# EAGLE design 5V+9V (EAGLE 5.10)
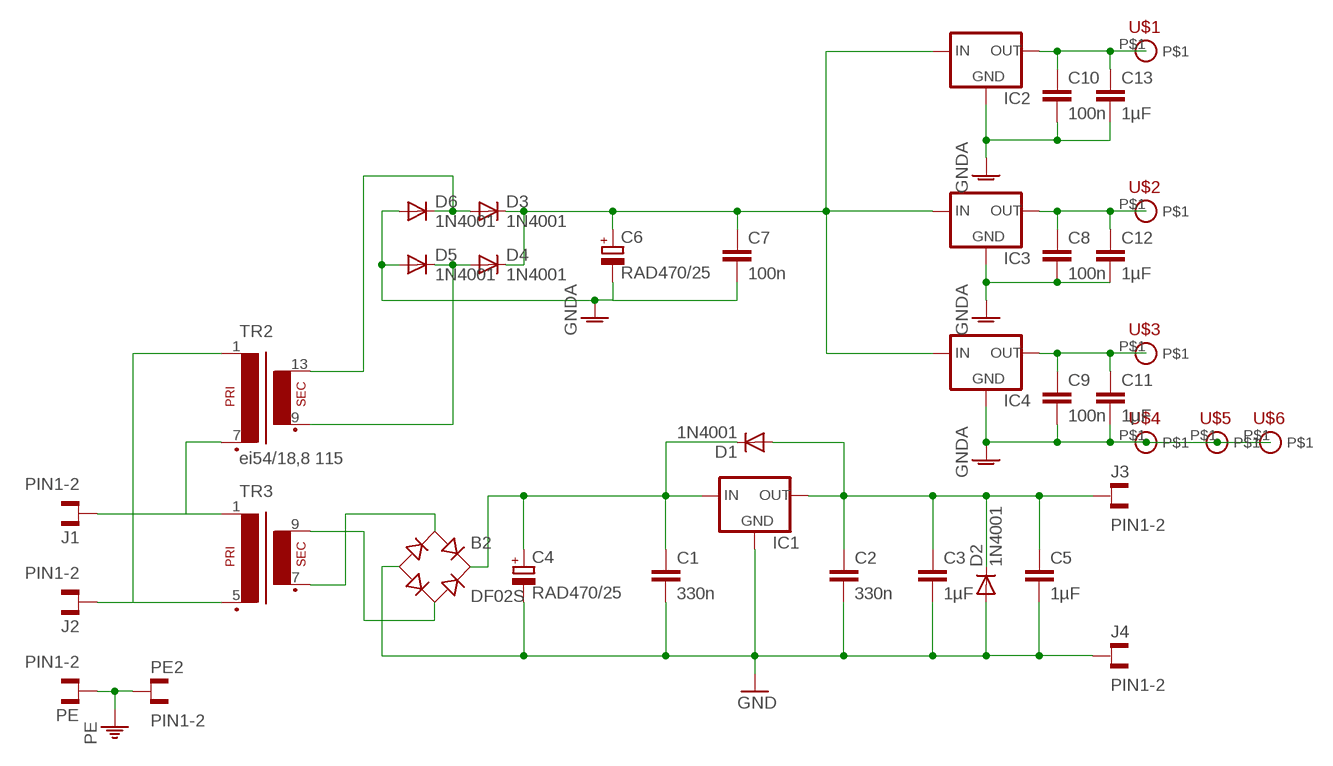
[diagram p0: schematic, sheet 1]

## Parts
B2  DF02S  [DFS]
C1  330n  C-EUC1812K  [C1812K]
C2  330n  C-EUC1812K  [C1812K]
C3  1µF  C-EUC0805  [C0805]
C4  RAD470/25  CPOL-EUE7.5-18  [E7,5-18]
C5  1µF  C-EUC0805  [C0805]
C6  RAD470/25  CPOL-EUE7.5-18  [E7,5-18]
C7  100n  C-EUC0805  [C0805]
C8  100n  C-EUC0805  [C0805]
C9  100n  C-EUC0805  [C0805]
C10  100n  C-EUC0805  [C0805]
C11  1µF  C-EUC0805  [C0805]
C12  1µF  C-EUC0805  [C0805]
C13  1µF  C-EUC0805  [C0805]
D1  1N4001  1N4148DO35-7  [DO35-7]
D2  1N4001  1N4148DO35-7  [DO35-7]
D3  1N4001  1N4004  [DO41-10]
D4  1N4001  1N4004  [DO41-10]
D5  1N4001  1N4004  [DO41-10]
D6  1N4001  1N4004  [DO41-10]
IC1  78XXL  [78XXL]
IC2  78XXS  [78XXS]
IC3  78XXS  [78XXS]
IC4  78XXS  [78XXS]
J1  PIN1-2  [62221]
J2  PIN1-2  [62221]
J3  PIN1-2  [62221]
J4  PIN1-2  [62221]
PE  PIN1-2  [62221]
PE2  PIN1-2  [62221]
TR2  ei54/18,8 115  EI54-1  [EI54-1]
TR3  EI38-1  [EI38-1]
U$1  1PIN  [1PIN]
U$2  1PIN  [1PIN]
U$3  1PIN  [1PIN]
U$4  1PIN  [1PIN]
U$5  1PIN  [1PIN]
U$6  1PIN  [1PIN]

## Nets
GND: B2.- C1.2 C2.2 C3.2 C4.- C5.2 D2.A IC1.GND J4.1
GNDA: C6.- C7.2 C8.2 C9.2 C10.2 C11.2 C12.2 C13.2 D5.A D6.A IC2.GND IC3.GND IC4.GND U$4.P$1 U$5.P$1 U$6.P$1
N$1: B2.AC2 TR3.9(S4)
N$2: B2.AC1 TR3.7(S3)
N$3: B2.+ C1.1 C4.+ D1.C IC1.IN
N$4: C2.1 C3.1 C5.1 D1.A D2.C IC1.OUT J3.1
N$5: J1.1 TR2.7(P2) TR3.1
N$6: D3.A D6.C TR2.13(S4)
N$9: D4.A D5.C TR2.9(S3)
N$10: J2.1 TR2.1 TR3.5(P2)
N$11: C6.+ C7.1 D3.C D4.C IC2.IN IC3.IN IC4.IN
N$13: C10.1 C13.1 IC2.OUT U$1.P$1
N$14: C8.1 C12.1 IC3.OUT U$2.P$1
N$15: C9.1 C11.1 IC4.OUT U$3.P$1
PE: PE2.1 PE.1

## Library data of the parts
B2 = rectifier:DF*S: Surface Mount Glass Passivated Bridge Rectifiers Source: Source: Comchip Bridge Rectifiers DF005S-G thru DF10S-G.pdf
C1-C3 C5 C7-C13 = rcl:C-EU: CAPACITOR, European symbol
C4 C6 = rcl:CPOL-EU: POLARIZED CAPACITOR, European symbol
D1 D2 = diode:1N4148: DIODE high speed (Philips)
D3-D6 = diode:1N4004: DIODE general purpose rectifier, 1 A
IC1 = v-reg:78XXL: VOLTAGE REGULATOR
IC2-IC4 = v-reg:78XXS: VOLTAGE REGULATOR
J1-J4 PE PE2 = con-faston:PIN1-2: CONN TAB FASTON BRASS .187 PCB TAB, FSSTON, DUAL STAKE, .187 SERIES Digi-Key Part Number: A24734CT-ND Source: Tyco Electronics Corporation .. ENG_CD_62221_R.pdf http://search.digikey.com/scripts/DkSearch/dksus.dll?Detail&name=A24734CT-ND
TR2 = trafo:EI54-1: TRANSFORMER 1 primary winding, 1 secondary winding ERA
TR3 = trafo:EI38-1: TRANSFORMER 1 primary winding, 1 secondary winding ERA
U$1-U$6 = pins:1PIN

## Board
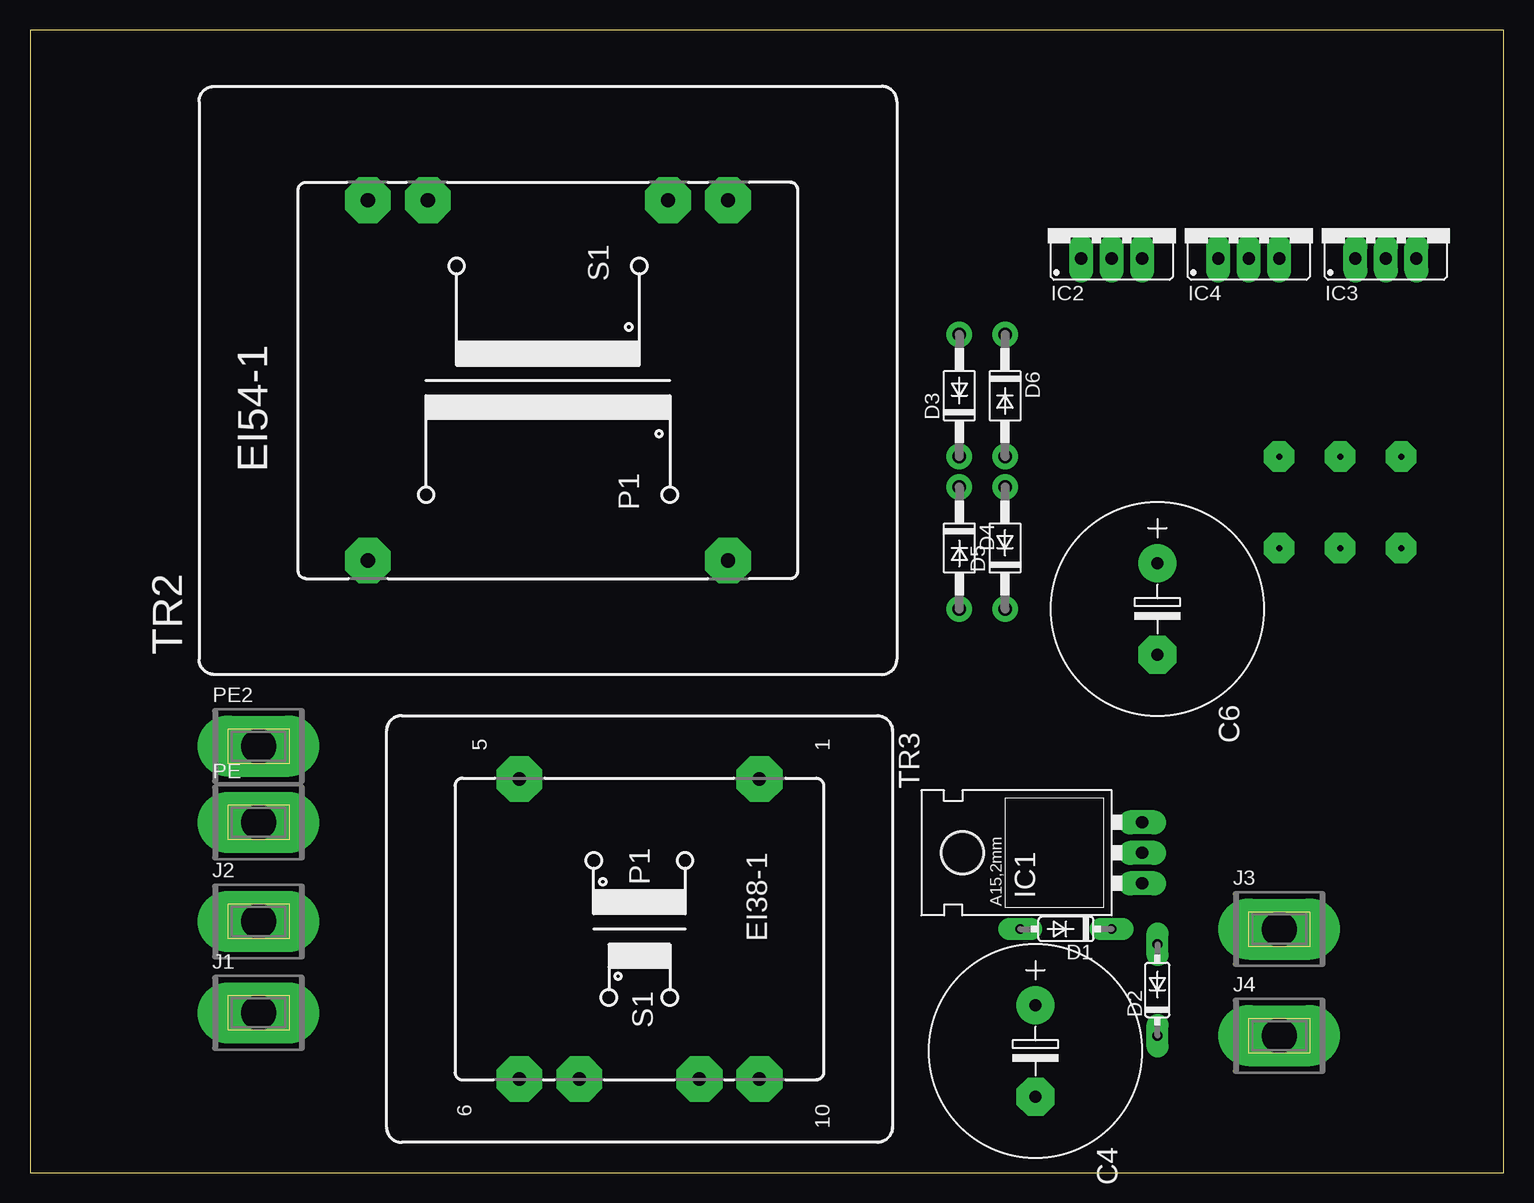
[diagram p1: board, top side]
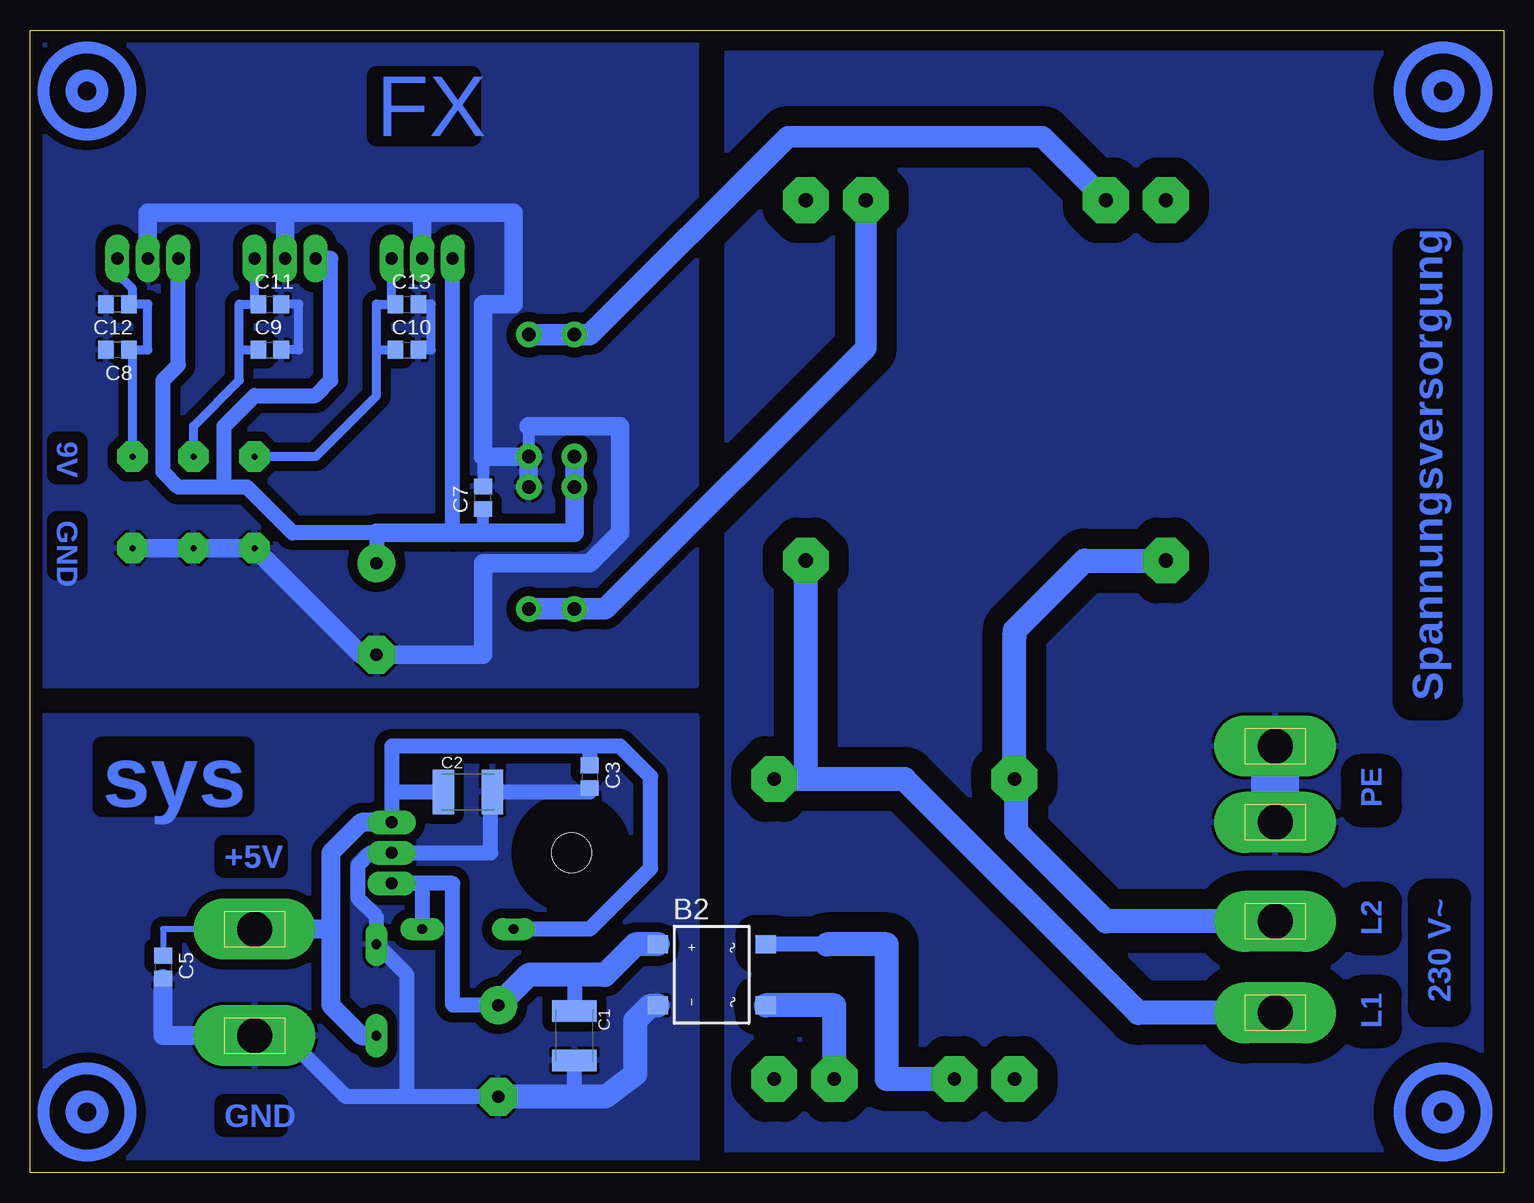
[diagram p2: board, bottom side, seen from below]

Size 122.86 x 95.24 mm. Coordinates in mm from the lower left corner, seen from the top.
Outline: 0,0 122.86,0 122.86,95.24 0,95.24 0,0
Copper layers (1*16): Top 0.035mm / dielectric 1.5mm / Bottom 0.035mm
Design rules "default *": minimum track width 0.5mm, minimum drill 0.8mm, track to track 0.5mm, track to pad 8mil, pad to pad 8mil, via to via 8mil, smd to smd 8mil, copper to edge 40mil, drill to drill 8mil, minimum pad ring 0.5mm, minimum via ring 8mil, stop-mask expansion 4mil, vias tented up to drill 0mil, thermal gap 10mil

### Footprints (pad centres in the part's own frame; a part is rotated, then mirrored left to right if it is on the bottom)
DFS = smd 1.5 x 1.7: + -2.55,-4.5; - 2.55,-4.5; AC1 -2.55,4.5; AC2 2.55,4.5
C1812K = smd 1.8 x 3.7: 1 -2.05,0; 2 2.05,0
C0805 = smd 1.3 x 1.5: 1 -0.95,0; 2 0.95,0
E7,5-18 = drill 1.016 pad 3.15 round: + -3.81,0 | drill 1.016 pad 3.15 octagon: - 3.81,0
DO35-7 = drill 0.813 long: A 3.81,0; C -3.81,0
DO41-10 = drill 1.118 round: A 5.08,0; C -5.08,0
78XXL = drill 1.016 long: GND 0,-3.81; IN -2.54,-3.81; OUT 2.54,-3.81 | hole 3.302: 0,11.176
78XXS = drill 1.016 long: GND 0,-2.54; IN -2.54,-2.54; OUT 2.54,-2.54
62221 = drill 2.921 pad 5.08 long: 1 0,0
EI54-1 = drill 1.194 pad 3.81 octagon: 1 -15.011,15.011; 7 -15.011,-15.011; 8 15.011,-15.011; 9 15.011,-10.008; 13 15.011,10.008; 14 15.011,15.011
EI38-1 = drill 1.118 pad 3.81 octagon: 1 -12.497,10.008; 5 -12.497,-10.008; 6 12.497,-10.008; 7 12.497,-5.004; 9 12.497,5.004; 10 12.497,10.008
1PIN = drill 0.5 pad 2.54 octagon: P$1 0,0

### Placement (x,y rotation side)
B2  66.04,16.51 270 bottom
C1  77.47,11.43 270 bottom
C2  86.36,31.75 0 bottom
C3  76.2,33.02 270 bottom
C4  83.82,10.16 270 top
C5  111.76,17.14 270 bottom
C6  93.98,46.99 270 top
C7  85.09,56.26 90 bottom
C8  115.57,68.58 180 bottom
C9  102.87,68.58 0 bottom
C10  91.44,68.58 0 bottom
C11  102.87,72.39 0 bottom
C12  115.57,72.39 180 bottom
C13  91.44,72.39 0 bottom
D1  86.36,20.32 180 top
D2  93.98,15.24 90 top
D3  77.47,64.77 90 top
D4  77.47,52.07 270 top
D5  81.28,52.07 90 top
D6  81.28,64.77 270 top
IC1  88.9,26.67 90 top
IC2  90.17,78.74 0 top
IC3  113.03,78.74 0 top
IC4  101.6,78.74 0 top
J1  19.05,13.34 0 top
J2  19.05,20.95 0 top
J3  104.14,20.32 0 top
J4  104.14,11.43 0 top
PE  19.05,29.21 0 top
PE2  19.05,35.56 0 top
TR2  43.18,66.04 90 top
TR3  50.8,20.32 270 top
U$1  104.14,59.69 0 top
U$2  114.3,59.69 0 top
U$3  109.22,59.69 0 top
U$4  114.3,52.07 0 top
U$5  109.22,52.07 0 top
U$6  104.14,52.07 0 top

### Tracks (layer width: path | path; a pad name or v marks a point on that pad's centre or on a via)
GND
  Bottom 1.27: 87.63,6.35 77.47,6.35 C1.2 | C3.2 76.2,31.75 C2.2 84.45,31.75 84.45,26.67 IC1.GND 94.49,26.67 95.5,25.65 95.5,22.86 93.98,21.34 D2.A 91.44,16.51 91.44,6.35 | C4.- 91.44,6.35 | 91.44,6.35 96.52,6.35 101.6,11.43 J4.1
  Bottom 1.6: C5.2 111.76,11.43 J4.1
  Bottom 2: B2.- 71.13,13.96 72.39,12.7 72.39,8.26 74.93,6.35 C4.-
  pour Bottom (isolate 0.813): 67.31,38.1 67.31,0 123.19,0 123.19,38.1
GNDA
  Bottom 0.61: 85.09,43.18 95.25,43.18
  Bottom 0.762: C10.2 89.41,68.58 89.41,72.39 C13.2 | C9.2 100.46,68.58 100.46,72.39 C11.2
  Bottom 1: 81.28,62.23 D6.A | 85.09,59.69 C7.2
  Bottom 1.524: D5.A D6.A 85.09,59.69 85.09,72.39 82.55,72.39 82.55,80.01 90.17,80.01 | 90.17,80.01 IC2.GND | 90.17,80.01 101.6,80.01 | 101.6,80.01 IC4.GND | IC3.GND 113.03,80.01 101.6,80.01 | 81.28,62.23 73.66,62.23 73.66,53.34 76.2,50.8 85.09,50.8 85.09,43.18 C6.- 95.25,43.18 U$6.P$1 U$5.P$1 U$4.P$1
  pour Bottom (isolate 0.813): 123.19,40.64 67.31,40.64 67.31,95.25 123.19,95.25
N$1
  Bottom 2: TR3.9 55.8,13.96 B2.AC2
N$2
  Bottom 1.27: 56.46,19.05 B2.AC1
  Bottom 2: TR3.7 51.44,7.82 51.44,19.05 56.46,19.05
N$3
  Bottom 1.27: 74.93,16.51 77.47,16.51 C1.1 | C4.+ 87.63,13.97 87.63,24.13 IC1.IN 90.17,24.13 D1.C
  Bottom 2: B2.+ 72.39,19.05 74.93,16.51 81.28,16.51 C4.+
N$4
  Bottom 0.508: J3.1 111.76,20.32 C5.1
  Bottom 1.27: D1.A 76.2,20.32 71.12,25.4 71.12,33.02 73.66,35.56 76.2,35.56 | 76.2,35.56 92.71,35.56 92.71,31.75 | 76.2,35.56 C3.1 | 92.71,31.75 C2.1 | 92.71,31.75 IC1.OUT
  Bottom 1.6: IC1.OUT 95.25,29.21 97.79,26.67 97.79,20.32 | 97.79,20.32 97.79,13.97 95.25,11.43 D2.C | 97.79,20.32 J3.1
N$5
  Bottom 2: 58.19,32.82 TR2.7 | J1.1 30.48,13.34 49.96,32.82 58.19,32.82 | 58.19,32.82 TR3.1
N$6
  Bottom 1.778: TR2.13 38.48,86.36 59.69,86.36 76.2,69.85 D3.A D6.C
N$9
  Bottom 1.778: TR2.9 53.19,68.73 74.93,46.99 D4.A D5.C
N$10
  Bottom 2: TR2.1 34.95,51.03 40.77,45.21 40.79,44.68 TR3.5 40.64,33.02 40.64,28.42 33.17,20.95 J2.1
N$11
  Bottom 1: D3.C D4.C | 85.09,53.34 C7.1
  Bottom 1.27: IC3.IN 110.49,67.31 111.76,66.04 111.76,58.42 110.49,57.15 106.68,57.15 | 106.68,57.15 104.78,57.15 100.97,53.34 93.98,53.34 C6.+ | 106.68,57.15 106.68,62.23 104.14,64.77 99.06,64.77 97.79,66.04 97.79,76.2 IC4.IN | 87.63,53.34 IC2.IN
  Bottom 1.524: D3.C 77.47,53.34 85.09,53.34 87.63,53.34 93.98,53.34
N$13
  Bottom 0.762: IC2.OUT 92.71,72.39 C13.1 93.98,72.39 93.98,68.58 | 93.98,68.58 C10.1 | 93.98,68.58 93.98,64.77 99.06,59.69 U$1.P$1
N$14
  Bottom 0.762: IC3.OUT 115.57,74.93 114.3,73.66 114.3,72.71 C12.1 113.03,72.39 113.03,68.58 C8.1 114.3,68.26 U$2.P$1
N$15
  Bottom 0.762: IC4.OUT 104.14,72.39 C11.1 105.41,72.39 105.41,68.58 | 105.41,68.58 C9.1 | U$3.P$1 109.22,62.23 105.41,66.04 105.41,68.58
PE
  Bottom 4: PE.1 PE2.1
  pour Bottom (isolate 1.676): 0,0 0,95.25 64.77,95.25 64.77,0
(copper drawn outside any net)
  shapes: Bottom circle x8

### Text on the board
Bottom: FX | 9V | GND | Spannungsversorgung | PE | sys | +5V | 230 V~ | L2 | L1 | GND